# Altium project stm-hydro-top-board.PrjPcb
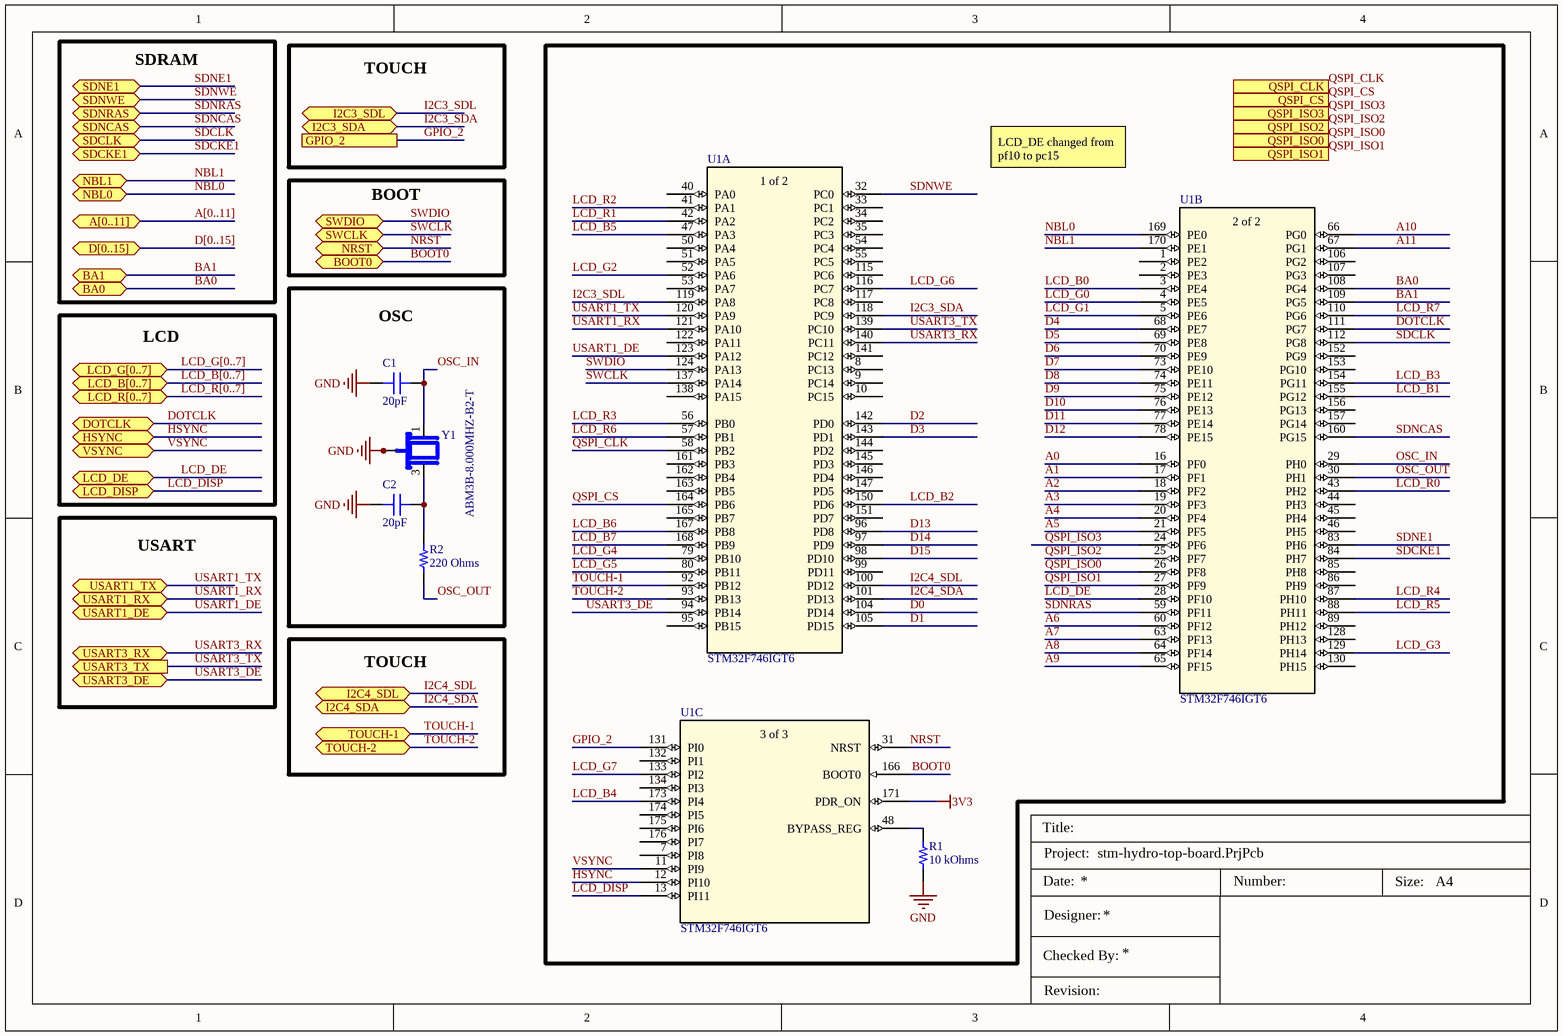
[diagram p0: STM-connections.SchDoc]
5 sheets, 47 parts. Net scope: flat (ports and power ports of the same name join across sheets).
Board file: PCB2.PcbDoc
Sheets:
  STM-connections.SchDoc
  STM-power-boot.SchDoc
  SDram.SchDoc
  LCD-connector.SchDoc
  BOARD-connector.SchDoc

## Sheet STM-connections.SchDoc
size A4; Organization: Altium Limited; Address1: L3, 12a Rodborough Rd; Address2: Frenchs Forest; Address3: NSW; Address4: Australia 2086

### Parts
C1  20pF  [CAP 0603_1608]
C2  20pF  [CAP 0603_1608]
R1  10 kOhms  [RES 0603_1608]
R2  220 Ohms  [RES 0603_1608]
U1  STM32F746IGT6  [LQFP176_24X24_STM]  (parts A,B,C of 4)
Y1  ABM3B-8.000MHZ-B2-T  [OSC_ABM3B-8.000MHZ-B2-T]

### Blocks framed on the sheet
OSC: C1 C2 R2 Y1

### Ports
A[0..11] (bidir), BA0 (bidir), BA1 (bidir), BOOT0 (bidir), D[0..15] (bidir), DOTCLK (bidir), GPIO_2, HSYNC (bidir), I2C3_SDA (bidir), I2C3_SDL (bidir), I2C4_SDA (bidir), I2C4_SDL (bidir), LCD_B[0..7] (bidir), LCD_DE (bidir), LCD_DISP (bidir), LCD_G[0..7] (bidir), LCD_R[0..7] (bidir), NBL0 (bidir), NBL1 (bidir), NRST (bidir), QSPI_CLK, QSPI_CS, QSPI_ISO0, QSPI_ISO1, QSPI_ISO2, QSPI_ISO3, SDCKE1 (bidir), SDCLK (bidir), SDNCAS (bidir), SDNE1 (bidir), SDNRAS (bidir), SDNWE (bidir), SWCLK (bidir), SWDIO (bidir), TOUCH-1 (bidir), TOUCH-2 (bidir), USART1_DE (bidir), USART1_RX (bidir), USART1_TX (bidir), USART3_DE (bidir), USART3_RX (bidir), USART3_TX (out), VSYNC (bidir)

### Nets
3V3: U1.171(PDR_ON)
GND: C1.1 C2.1 R1.1 Y1.2(GND) Y1.4(GND)
A0: U1.16(PF0)
A1: U1.17(PF1)
A2: U1.18(PF2)
A3: U1.19(PF3)
A4: U1.20(PF4)
A5: U1.21(PF5)
A6: U1.60(PF12)
A7: U1.63(PF13)
A8: U1.64(PF14)
A9: U1.65(PF15)
A10: U1.66(PG0)
A11: U1.67(PG1)
BA0: U1.108(PG4) ; port BA0
BA1: U1.109(PG5) ; port BA1
BOOT0: U1.166(BOOT0) ; port BOOT0
D0: U1.104(PD14)
D1: U1.105(PD15)
D2: U1.142(PD0)
D3: U1.143(PD1)
D4: U1.68(PE7)
D5: U1.69(PE8)
D6: U1.70(PE9)
D7: U1.73(PE10)
D8: U1.74(PE11)
D9: U1.75(PE12)
D10: U1.76(PE13)
D11: U1.77(PE14)
D12: U1.78(PE15)
D13: U1.96(PD8)
D14: U1.97(PD9)
D15: U1.98(PD10)
DOTCLK: U1.111(PG7) ; port DOTCLK
GPIO_2: U1.131(PI0) ; port GPIO_2
HSYNC: U1.12(PI10) ; port HSYNC
I2C3_SDA: U1.118(PC9) ; port I2C3_SDA
I2C3_SDL: U1.119(PA8) ; port I2C3_SDL
I2C4_SDA: U1.101(PD13) ; port I2C4_SDA
I2C4_SDL: U1.100(PD12) ; port I2C4_SDL
LCD_B0: U1.3(PE4)
LCD_B1: U1.155(PG12)
LCD_B2: U1.150(PD6)
LCD_B3: U1.154(PG11)
LCD_B4: U1.173(PI4)
LCD_B5: U1.47(PA3)
LCD_B6: U1.167(PB8)
LCD_B7: U1.168(PB9)
LCD_DE: U1.28(PF10) ; port LCD_DE
LCD_DISP: U1.13(PI11) ; port LCD_DISP
LCD_G0: U1.4(PE5)
LCD_G1: U1.5(PE6)
LCD_G2: U1.52(PA6)
LCD_G3: U1.129(PH14)
LCD_G4: U1.79(PB10)
LCD_G5: U1.80(PB11)
LCD_G6: U1.116(PC7)
LCD_G7: U1.133(PI2)
LCD_R0: U1.43(PH2)
LCD_R1: U1.42(PA2)
LCD_R2: U1.41(PA1)
LCD_R3: U1.56(PB0)
LCD_R4: U1.87(PH10)
LCD_R5: U1.88(PH11)
LCD_R6: U1.57(PB1)
LCD_R7: U1.110(PG6)
NBL0: U1.169(PE0) ; port NBL0
NBL1: U1.170(PE1) ; port NBL1
NRST: U1.31(NRST) ; port NRST
OSC_IN: C1.2 U1.29(PH0) Y1.1
OSC_OUT: R2.2 U1.30(PH1)
QSPI_CLK: U1.58(PB2) ; port QSPI_CLK
QSPI_CS: U1.164(PB6) ; port QSPI_CS
QSPI_ISO0: U1.26(PF8) ; port QSPI_ISO0
QSPI_ISO1: U1.27(PF9) ; port QSPI_ISO1
QSPI_ISO2: U1.25(PF7) ; port QSPI_ISO2
QSPI_ISO3: U1.24(PF6) ; port QSPI_ISO3
SDCKE1: U1.84(PH7) ; port SDCKE1
SDCLK: U1.112(PG8) ; port SDCLK
SDNCAS: U1.160(PG15) ; port SDNCAS
SDNE1: U1.83(PH6) ; port SDNE1
SDNRAS: U1.59(PF11) ; port SDNRAS
SDNWE: U1.32(PC0) ; port SDNWE
SWCLK: U1.137(PA14) ; port SWCLK
SWDIO: U1.124(PA13) ; port SWDIO
TOUCH-1: U1.92(PB12) ; port TOUCH-1
TOUCH-2: U1.93(PB13) ; port TOUCH-2
USART1_DE: U1.123(PA12) ; port USART1_DE
USART1_RX: U1.121(PA10) ; port USART1_RX
USART1_TX: U1.120(PA9) ; port USART1_TX
USART3_DE: U1.94(PB14) ; port USART3_DE
USART3_RX: U1.140(PC11) ; port USART3_RX
USART3_TX: U1.139(PC10) ; port USART3_TX
VSYNC: U1.11(PI9) ; port VSYNC
NetC2_2: C2.2 R2.1 Y1.3
NetR1_2: R1.2 U1.48(BYPASS_REG)

Not connected (* = marked no-connect by the designer): U1 1(PE2) 2(PE3) 7(PI8) 8(PC13) 9(PC14) 10(PC15) 33(PC1) 34(PC2) 35(PC3) 40(PA0) 44(PH3) 45(PH4) 46(PH5) 50(PA4) 51(PA5) 53(PA7) 54(PC4) 55(PC5) 85(PH8) 86(PH9) 89(PH12) 95(PB15) 99(PD11) 106(PG2) 107(PG3) 115(PC6) 117(PC8) 122(PA11) 128(PH13) 130(PH15) 132(PI1) 134(PI3) 138(PA15) 141(PC12) 144(PD2) 145(PD3) 146(PD4) 147(PD5) 151(PD7) 152(PG9) 153(PG10) 156(PG13) 157(PG14) 161(PB3) 162(PB4) 163(PB5) 165(PB7) 174(PI5) 175(PI6) 176(PI7)

### Buses and harness runs
bus A[0..11] = port A[0..11]
bus D[0..15] = port D[0..15]
bus LCD_B[0..7] = port LCD_B[0..7]
bus LCD_G[0..7] = port LCD_G[0..7]
bus LCD_R[0..7] = port LCD_R[0..7]

### Notes on the sheet
- SDRAM
- TOUCH
- LCD_DE changed from pf10 to pc15
- BOOT
- LCD
- USART
- Title:
- Project:
- Date:
- Designer:
- Number:
- Size:
- A4
- Checked By:
- Revision:
- (in symbol STM32F746IGT6, part A) 1 of 2
- (in symbol STM32F746IGT6, part B) 2 of 2
- (in symbol STM32F746IGT6, part C) 3 of 3

### Library data of the parts
C1 C2 = CC0603JRNPO0BN200: CAP CER 20PF 100V C0G/NPO 0603; Part Number: CC0603JRNPO0BN200; Value: 20pF
R1 = CRCW060310K0FKEAHP: RES SMD 10K OHM 1% 1/4W 0603; Part Number: CRCW060310K0FKEAHP; Value: 10 kOhms
R2 = CRCW0603220RJNEAHP: RES SMD 220 OHM 5% 1/4W 0603; Part Number: CRCW0603220RJNEAHP; Value: 220 Ohms
U1 = STM32F746IGT6: No Description Available; Built_By: EMA_Jessica; Vendor: STMicroelectronics; SourceLibrary: Add_to_database_2020-10-19; Copyright: Copyright (C) 2018 Accelerated Designs. All rights reserved; Manufacturer_Part_Number: STM32F746IGT6; RefDes: RefDes; Type: DEV
Y1 = ABM3B-8.000MHZ-B2-T: 8MHz Â±20ppm Crystal 18pF 200 Ohms 4-SMD, No Lead; MF: Abracon; Check_prices: https://www.snapeda.com/parts/ABM3B-8.000MHZ-B2-T/Abracon%20LLC/view-part/42698/?ref=eda; Price: None; SnapEDA_Link: https://www.snapeda.com/parts/ABM3B-8.000MHZ-B2-T/Abracon%20LLC/view-part/42698/?ref=snap; MP: ABM3B-8.000MHZ-B2-T; Value: *; Availability: Good; Package: SMD-4 Abracon LLC; Purchase-URL: https://pricing.snapeda.com/search/part/ABM3B-8.000MHZ-B2-T/?ref=eda

## Sheet STM-power-boot.SchDoc
size A4; Organization: Altium Limited; Address1: L3, 12a Rodborough Rd; Address2: Frenchs Forest; Address3: NSW; Address4: Australia 2086
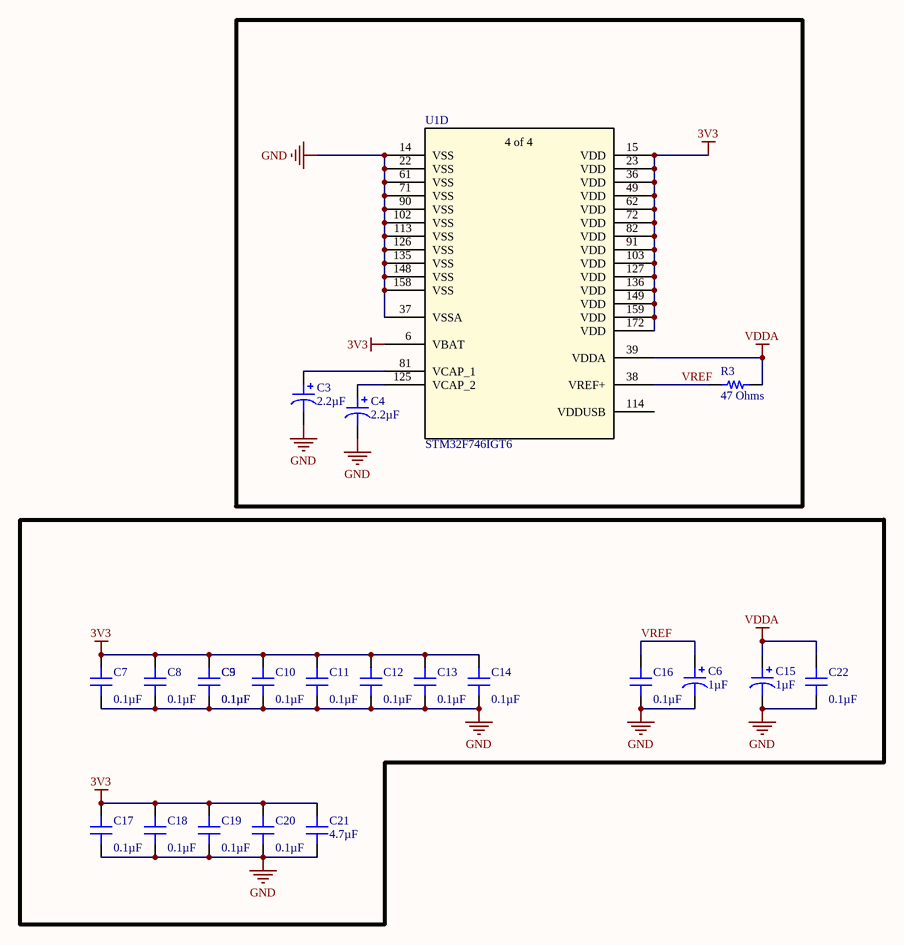
[diagram p1: STM-power-boot.SchDoc]

### Parts
C3  2.2µF  [CAP POL 1411_3528]
C4  2.2µF  [CAP POL 1411_3528]
C5  0.1µF  [CAP 0603_1608]
C6  1µF  [CAP POL 1206_3216]
C7  0.1µF  [CAP 0603_1608]
C8  0.1µF  [CAP 0603_1608]
C9  0.1µF  [CAP 0603_1608]
C10  0.1µF  [CAP 0603_1608]
C11  0.1µF  [CAP 0603_1608]
C12  0.1µF  [CAP 0603_1608]
C13  0.1µF  [CAP 0603_1608]
C14  0.1µF  [CAP 0603_1608]
C15  1µF  [CAP POL 1206_3216]
C16  0.1µF  [CAP 0603_1608]
C17  0.1µF  [CAP 0603_1608]
C18  0.1µF  [CAP 0603_1608]
C19  0.1µF  [CAP 0603_1608]
C20  0.1µF  [CAP 0603_1608]
C21  4.7µF  [CAP 0603_1608]
C22  0.1µF  [CAP 0603_1608]
R3  47 Ohms  [RES 0805_2012]
U1  STM32F746IGT6  [LQFP176_24X24_STM]  (part D of 4)

### Nets
3V3: C5.2 C7.2 C8.2 C9.2 C10.2 C11.2 C12.2 C13.2 C14.2 C17.2 C18.2 C19.2 C20.2 C21.2 U1.6(VBAT) U1.15(VDD) U1.23(VDD) U1.36(VDD) U1.49(VDD) U1.62(VDD) U1.72(VDD) U1.82(VDD) U1.91(VDD) U1.103(VDD) U1.127(VDD) U1.136(VDD) U1.149(VDD) U1.159(VDD) U1.172(VDD)
GND: C3.2 C4.2 C5.1 C6.2 C7.1 C8.1 C9.1 C10.1 C11.1 C12.1 C13.1 C14.1 C15.2 C16.1 C17.1 C18.1 C19.1 C20.1 C21.1 C22.1 U1.14(VSS) U1.22(VSS) U1.37(VSSA) U1.61(VSS) U1.71(VSS) U1.90(VSS) U1.102(VSS) U1.113(VSS) U1.126(VSS) U1.135(VSS) U1.148(VSS) U1.158(VSS)
VDDA: C15.1 C22.2 R3.1 U1.39(VDDA)
VREF: C6.1 C16.2 R3.2 U1.38(VREF+)
NetC3_1: C3.1 U1.81(VCAP_1)
NetC4_1: C4.1 U1.125(VCAP_2)

Not connected (* = marked no-connect by the designer): U1 114(VDDUSB)

### Notes on the sheet
- Title:
- Project:
- Date:
- Designer:
- Number:
- Size:
- A4
- Checked By:
- Revision:
- (in symbol STM32F746IGT6, part D) 4 of 4

### Library data of the parts
C3 C4 = T496B225M016ATE3K5: CAP TANT 2.2UF 20% 16V 1411; Manufacturer: KEMET; Manufacturer Size Code: B; ESR (Equivalent Series Resistance): 3.5Ohm; Lifetime @ Temp.: 2000 Hrs @ 85°C; Type: Molded; Part Number: T496B225M016ATE3K5; Value: 2.2µF; Capacitance: 2.2µF; ComponentLink1Description: Datasheet; ComponentLink1URL: https://api.kemet.com/component-edge/download/datasheet/T496B225M016ATE3K5.pdf; ComponentLink2Description: DigiKey Link; ComponentLink2URL: http://digikey.com/product-detail/en/kemet/T496B225M016ATE3K5/399-3917-1-ND/819242; Device Package: 1411 (3528 Metric); Features: Fail Safe with Built-in Fuse; Height - Seated (Max): 0.083" (2.10mm); LastUpdated: 9/2/2020 1:15:46 AM; Lifecycle Status: Active; Minimum Order: 1; Mounting Type: Surface Mount; Operating Temperature: -55°C ~ 125°C; Package / Case: 1411 (3528 Metric); Packaging: TapeAndReel; PartId: 12; Part Status: Active; Price: 0.51; Series: T496; Size / Dimension: 0.138" L x 0.110" W (3.50mm x 2.80mm); Supplier 1: DigiKey; Supplier Part Number 1: 399-3917-1-ND; Tolerance: ±20%; Voltage - Rated: 16V
C5 C7-C14 C16-C20 C22 = 6R3X14W104MV4T: CAP CER 0.1UF 6.3V X7R 0603; Part Number: 6R3X14W104MV4T; Value: 0.1µF
C6 C15 = T494A105M016AT: CAP TANT 1UF 20% 16V 1206; Manufacturer: KEMET; Manufacturer Size Code: A; ESR (Equivalent Series Resistance): 6Ohm; Lifetime @ Temp.: 2000 Hrs @ 125°C; Type: Molded; Part Number: T494A105M016AT; Value: 1µF; Capacitance: 1µF; ComponentLink1Description: Datasheet; ComponentLink1URL: https://api.kemet.com/component-edge/download/datasheet/T494A105M016AT.pdf; ComponentLink2Description: DigiKey Link; ComponentLink2URL: http://digikey.com/product-detail/en/kemet/T494A105M016AT/399-8429-1-ND/3472152; Device Package: 1206 (3216 Metric); Features: General Purpose; Height - Seated (Max): 0.071" (1.80mm); LastUpdated: 9/2/2020 1:15:52 AM; Lifecycle Status: Active; Minimum Order: 1; Mounting Type: Surface Mount; Operating Temperature: -55°C ~ 125°C; Package / Case: 1206 (3216 Metric); Packaging: TapeAndReel; PartId: 2393; Part Status: Active; Price: 0.20; Series: T494; Size / Dimension: 0.126" L x 0.063" W (3.20mm x 1.60mm); Supplier 1: DigiKey; Supplier Part Number 1: 399-8429-1-ND; Tolerance: ±20%; Voltage - Rated: 16V
C21 = C0603C475K9PACTU: CAP CER 4.7UF 6.3V X5R 0603; Part Number: C0603C475K9PACTU; Value: 4.7µF
R3 = CRGP0805F47R: CRGP 0805 47R 1%; Manufacturer: TE Connectivity Passive Product; Power (Watts): 0.333W, 1/3W; Temperature Coefficient: ±200ppm/°C; Part Number: CRGP0805F47R; Value: 47 Ohms; ComponentLink1Description: Datasheet; ComponentLink1URL: https://www.te.com/commerce/DocumentDelivery/DDEController?Action=srchrtrv&DocNm=9-1773463-9&DocType=DS&DocLang=English; ComponentLink2Description: DigiKey Link; ComponentLink2URL: http://digikey.com/product-detail/en/te-connectivity-passive-product/CRGP0805F47R/A130461CT-ND/8578293; Composition: Thick Film; Device Package: 0805 (2012 Metric); Features: Pulse Withstanding; Height - Seated (Max): 0.026" (0.65mm); LastUpdated: 9/2/2020 1:15:22 AM; Lifecycle Status: Active; Minimum Order: 1; Number of Terminations: 2; Operating Temperature: -55°C ~ 155°C; Package / Case: 0805 (2012 Metric); Packaging: TapeAndReel; PartId: 28763; Part Status: Active; Price: 0.02; Resistance: 47 Ohms; Series: CRGP; Size / Dimension: 0.079" L x 0.049" W (2.00mm x 1.25mm); Supplier 1: DigiKey; Supplier Part Number 1: A130461CT-ND; Supplier Device Package: 0805; Tolerance: ±1%
U1 = STM32F746IGT6: as U1 on sheet STM-connections; Copyright: Copyright (C) 2018 Accelerated Designs. All rights reserved; Manufacturer_Part_Number: STM32F746IGT6; RefDes: RefDes; Type: DEV

## Sheet SDram.SchDoc
size A4; Organization: Altium Limited; Address1: L3, 12a Rodborough Rd; Address2: Frenchs Forest; Address3: NSW; Address4: Australia 2086
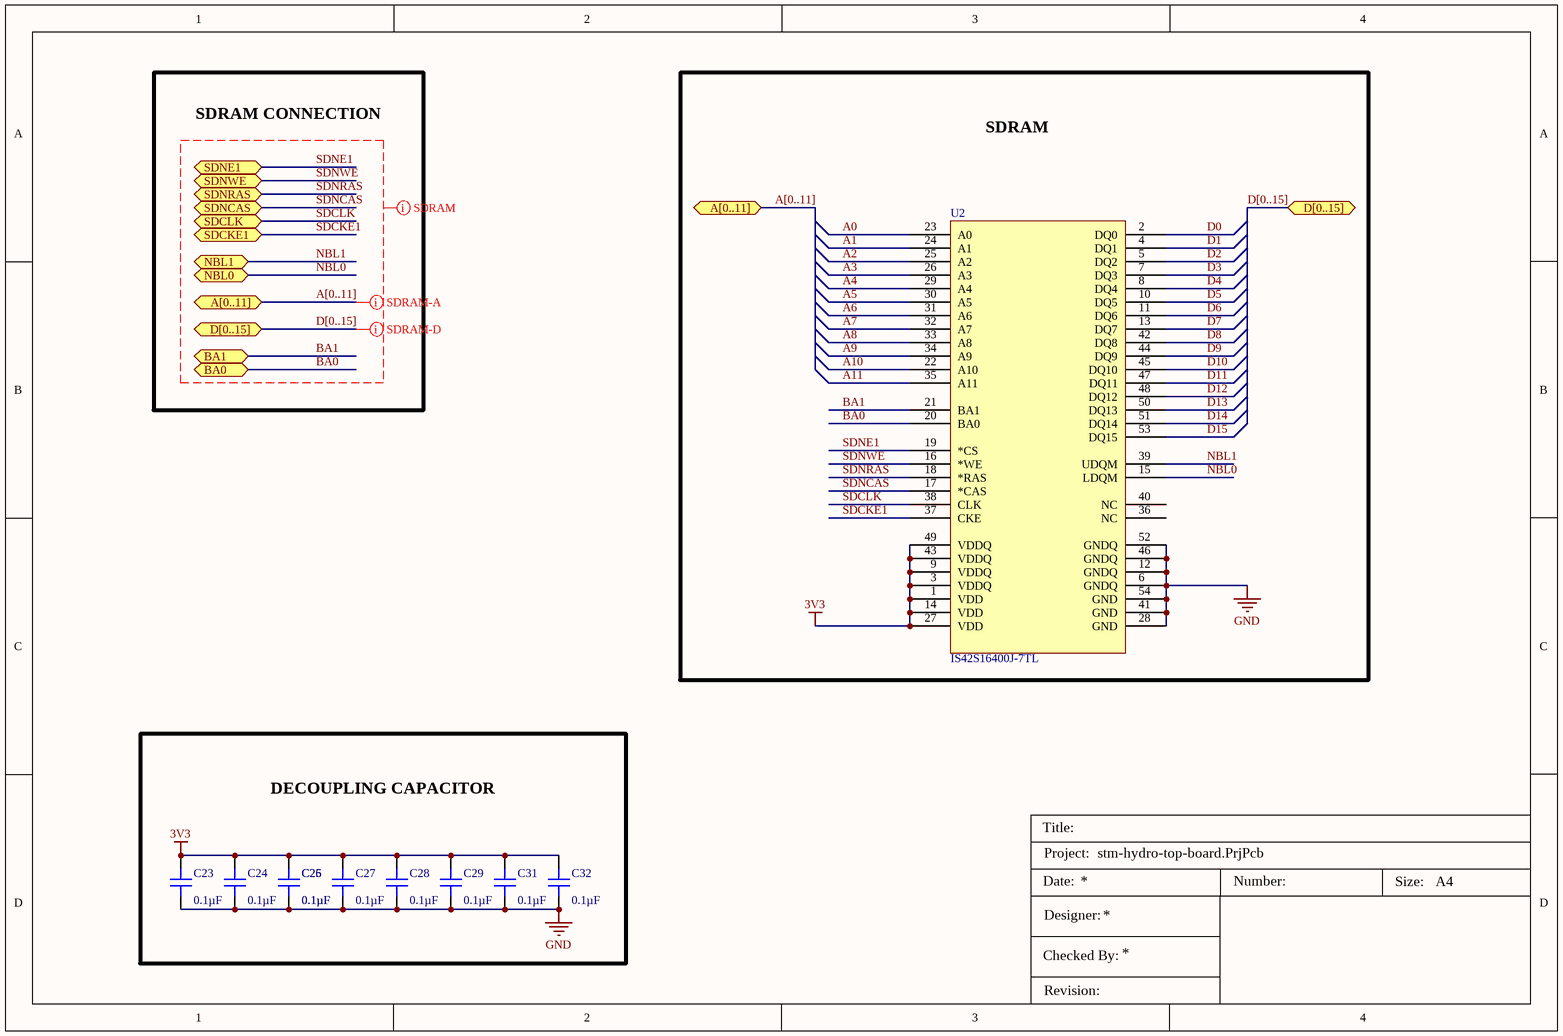
[diagram p2: SDram.SchDoc]

### Parts
C23  0.1µF  [CAP 0603_1608]
C24  0.1µF  [CAP 0603_1608]
C25  0.1µF  [CAP 0603_1608]
C26  0.1µF  [CAP 0603_1608]
C27  0.1µF  [CAP 0603_1608]
C28  0.1µF  [CAP 0603_1608]
C29  0.1µF  [CAP 0603_1608]
C31  0.1µF  [CAP 0603_1608]
C32  0.1µF  [CAP 0603_1608]
U2  IS42S16400J-7TL  [sdram]

### Blocks framed on the sheet
SDRAM: U2
DECOUPLING CAPACITOR: C23-C29 C31 C32

### Ports
A[0..11] (bidir), BA0 (bidir), BA1 (bidir), D[0..15] (bidir), NBL0 (bidir), NBL1 (bidir), SDCKE1 (bidir), SDCLK (bidir), SDNCAS (bidir), SDNE1 (bidir), SDNRAS (bidir), SDNWE (bidir)

### Nets
3V3: C23.2 C24.2 C25.2 C26.2 C27.2 C28.2 C29.2 C31.2 C32.2 U2.1(VDD) U2.3(VDDQ) U2.9(VDDQ) U2.14(VDD) U2.27(VDD) U2.43(VDDQ) U2.49(VDDQ)
GND: C23.1 C24.1 C25.1 C26.1 C27.1 C28.1 C29.1 C31.1 C32.1 U2.6(GNDQ) U2.12(GNDQ) U2.28(GND) U2.41(GND) U2.46(GNDQ) U2.52(GNDQ) U2.54(GND)
A0: U2.23(A0)
A1: U2.24(A1)
A2: U2.25(A2)
A3: U2.26(A3)
A4: U2.29(A4)
A5: U2.30(A5)
A6: U2.31(A6)
A7: U2.32(A7)
A8: U2.33(A8)
A9: U2.34(A9)
A10: U2.22(A10)
A11: U2.35(A11)
BA0: U2.20(BA0) ; port BA0
BA1: U2.21(BA1) ; port BA1
D0: U2.2(DQ0)
D1: U2.4(DQ1)
D2: U2.5(DQ2)
D3: U2.7(DQ3)
D4: U2.8(DQ4)
D5: U2.10(DQ5)
D6: U2.11(DQ6)
D7: U2.13(DQ7)
D8: U2.42(DQ8)
D9: U2.44(DQ9)
D10: U2.45(DQ10)
D11: U2.47(DQ11)
D12: U2.48(DQ12)
D13: U2.50(DQ13)
D14: U2.51(DQ14)
D15: U2.53(DQ15)
NBL0: U2.15(LDQM) ; port NBL0
NBL1: U2.39(UDQM) ; port NBL1
SDCKE1: U2.37(CKE) ; port SDCKE1
SDCLK: U2.38(CLK) ; port SDCLK
SDNCAS: U2.17(*CAS) ; port SDNCAS
SDNE1: U2.19(*CS) ; port SDNE1
SDNRAS: U2.18(*RAS) ; port SDNRAS
SDNWE: U2.16(*WE) ; port SDNWE

Not connected (* = marked no-connect by the designer): U2 36(NC) 40(NC)

### Buses and harness runs
bus A[0..11] = port A[0..11]
bus D[0..15] = port D[0..15]

### Layout directives
net class SDRAM: A[0..11], BA0, BA1, D[0..15], NBL0, NBL1, SDCKE1, SDCLK, SDNCAS, SDNE1, SDNRAS, SDNWE
net class SDRAM-A: A[0..11], BA0, BA1, D[0..15], NBL0, NBL1, SDCKE1, SDCLK, SDNCAS, SDNE1, SDNRAS, SDNWE
net class SDRAM-D: A[0..11], BA0, BA1, D[0..15], NBL0, NBL1, SDCKE1, SDCLK, SDNCAS, SDNE1, SDNRAS, SDNWE

### Notes on the sheet
- SDRAM CONNECTION
- Title:
- Project:
- Date:
- Designer:
- Number:
- Size:
- A4
- Checked By:
- Revision:

### Library data of the parts
C23-C29 C31 C32 = 6R3X14W104MV4T: CAP CER 0.1UF 6.3V X7R 0603; Part Number: 6R3X14W104MV4T; Value: 0.1µF
U2 = IS42S16400J-7TL: No Description AvailablSDRAM Memory IC 64Mb (4M x 16) Parallel 143 MHz 5.4 ns 54-TSOP IIe; Vendor: ISSI; Built_By: EMA_Cory; SourceLibrary: Add_to_database_2020-12-24; Datasheet: http://www.issi.com/WW/pdf/42-45S16400J.pdf; Manufacturer_Part_Number: IS42S16400J-7TL; Copyright: Copyright (C) 2018 Accelerated Designs. All rights reserved; RefDes: RefDes; Type: DEV; ComponentLink1Description: New link; ComponentLink1URL: https://www.digikey.be/en/products/detail/issi-integrated-silicon-solution-inc/IS42S16400J-7TL/2708623

## Sheet LCD-connector.SchDoc
size A4; Organization: Altium Limited; Address1: L3, 12a Rodborough Rd; Address2: Frenchs Forest; Address3: NSW; Address4: Australia 2086
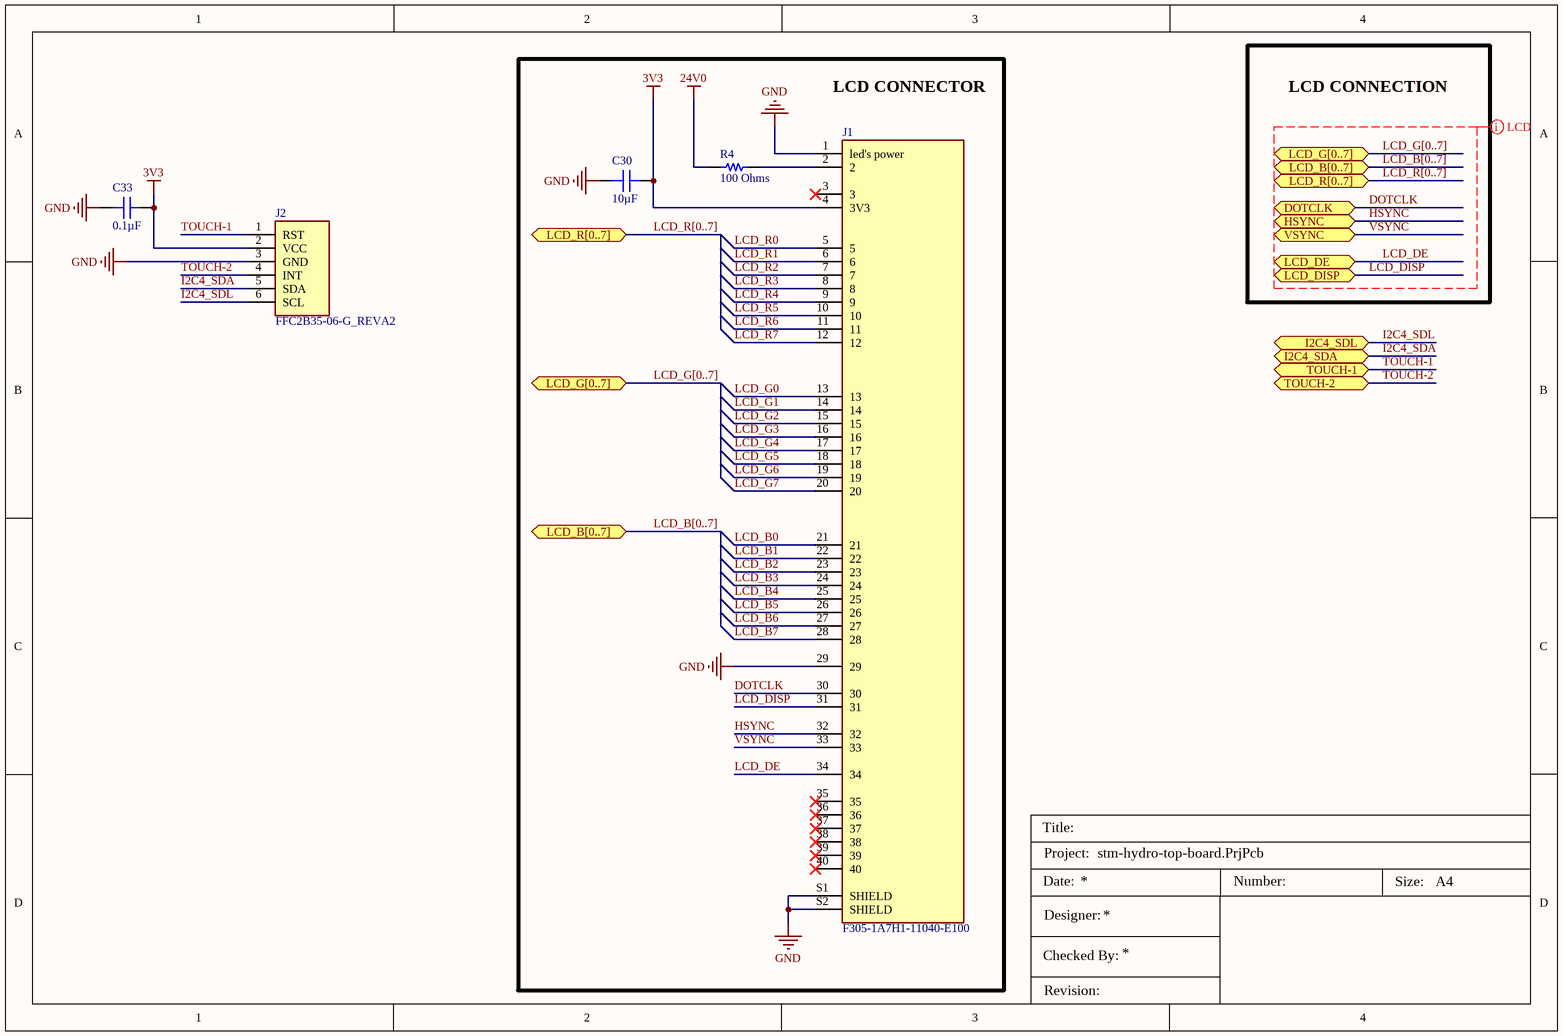
[diagram p3: LCD-connector.SchDoc]

### Parts
C30  10µF  [CAP 0805_2012]
C33  0.1µF  [CAP 0603_1608]
J1  F305-1A7H1-11040-E100  [F305-1A7H1-11040-E100]
J2  FFC2B35-06-G_REVA2  [GCT_FFC2B35-06-G_REVA2]
R4  100 Ohms  [RES 1206_3216]

### Blocks framed on the sheet
LCD CONNECTOR: C30 J1 R4

### Ports
DOTCLK (bidir), HSYNC (bidir), I2C4_SDA (bidir), I2C4_SDL (bidir), LCD_B[0..7] (bidir), LCD_DE (bidir), LCD_DISP (bidir), LCD_G[0..7] (bidir), LCD_R[0..7] (bidir), TOUCH-1 (bidir), TOUCH-2 (bidir), VSYNC (bidir)

### Nets
3V3: C30.2 C33.1 J1.4(3V3) J2.2(VCC)
24V0: R4.1
GND: C30.1 C33.2 J1.1(led's_power) J1.29 J1.S1(SHIELD) J1.S2(SHIELD) J2.3(GND)
DOTCLK: J1.30 ; port DOTCLK
HSYNC: J1.32 ; port HSYNC
I2C4_SDA: J2.5(SDA) ; port I2C4_SDA
I2C4_SDL: J2.6(SCL) ; port I2C4_SDL
LCD_B0: J1.21
LCD_B1: J1.22
LCD_B2: J1.23
LCD_B3: J1.24
LCD_B4: J1.25
LCD_B5: J1.26
LCD_B6: J1.27
LCD_B7: J1.28
LCD_DE: J1.34 ; port LCD_DE
LCD_DISP: J1.31 ; port LCD_DISP
LCD_G0: J1.13
LCD_G1: J1.14
LCD_G2: J1.15
LCD_G3: J1.16
LCD_G4: J1.17
LCD_G5: J1.18
LCD_G6: J1.19
LCD_G7: J1.20
LCD_R0: J1.5
LCD_R1: J1.6
LCD_R2: J1.7
LCD_R3: J1.8
LCD_R4: J1.9
LCD_R5: J1.10
LCD_R6: J1.11
LCD_R7: J1.12
TOUCH-1: J2.1(RST) ; port TOUCH-1
TOUCH-2: J2.4(INT) ; port TOUCH-2
VSYNC: J1.33 ; port VSYNC
NetJ1_2: J1.2 R4.2

Not connected (* = marked no-connect by the designer): J1 3* 35* 36* 37* 38* 39* 40*

### Buses and harness runs
bus LCD_B[0..7] = port LCD_B[0..7]
bus LCD_G[0..7] = port LCD_G[0..7]
bus LCD_R[0..7] = port LCD_R[0..7]

### Layout directives
net class LCD: DOTCLK, HSYNC, LCD_B[0..7], LCD_DE, LCD_DISP, LCD_G[0..7], LCD_R[0..7], VSYNC

### Notes on the sheet
- LCD CONNECTION
- Title:
- Project:
- Date:
- Designer:
- Number:
- Size:
- A4
- Checked By:
- Revision:

### Library data of the parts
C30 = CL21A106MQFNNNE: CAP CER 10UF 6.3V X5R 0805; Manufacturer: Samsung Electro-Mechanics; Tolerance: ±20%; Part Number: CL21A106MQFNNNE; Value: 10µF; Applications: General Purpose; Capacitance: 10µF; ComponentLink1Description: Datasheet; ComponentLink1URL: http://www.samsungsem.com/kr/support/product-search/mlcc/CL21A106MQFNNNE.jsp; ComponentLink2Description: DigiKey Link; ComponentLink2URL: http://digikey.com/product-detail/en/samsung-electro-mechanics/CL21A106MQFNNNE/1276-1298-1-ND/3889384; Device Package: 0805 (2012 Metric); LastUpdated: 9/2/2020 1:04:40 AM; Lifecycle Status: Active; Minimum Order: 1; Mounting Type: Surface Mount, MLCC; Operating Temperature: -55°C ~ 85°C; Package / Case: 0805 (2012 Metric); Packaging: TapeAndReel; PartId: 3169; Part Status: Active; Price: 0.02; Series: CL; Size / Dimension: 0.079" L x 0.049" W (2.00mm x 1.25mm); Supplier 1: DigiKey; Supplier Part Number 1: 1276-1298-1-ND; Temperature Coefficient: X5R; Thickness (Max): 0.053" (1.35mm); Voltage - Rated: 6.3V
C33 = 6R3X14W104MV4T: CAP CER 0.1UF 6.3V X7R 0603; Part Number: 6R3X14W104MV4T; Value: 0.1µF
J1 = LCD Connector: 40 Position FFC, FPC Connector Contacts, Bottom 0.020" (0.50mm) Surface Mount, Right Angle; MF: Amphenol ICC (FCI); MP: F305-1A7H1-11040-E100; Price: None; Availability: Unavailable; Package: None; Digikey_Link: https://www.digikey.com/en/products/detail/amphenol-icc-fci/F305-1A7H1-11040-E100/11564644; Value: *
J2 = FFC2B35-06-G_REVA2: 0.5mm Side entry Flat Flexible Cable Connector; MF: Global Connector Technology; SnapEDA_Link: https://www.snapeda.com/parts/FFC2B35-06-G/Global+Connector+Technology/view-part/?ref=snap; Price: None; Check_prices: https://www.snapeda.com/parts/FFC2B35-06-G/Global+Connector+Technology/view-part/?ref=eda; Availability: In Stock; Value: *; MP: FFC2B35-06-G; Package: None; Purchase-URL: https://pricing.snapeda.com/search/part/FFC2B35-06-G/?ref=eda
R4 = CRG1206F100R: RES SMD 100 OHM 1% 1/4W 1206; Manufacturer: TE Connectivity Passive Product; Power (Watts): 0.25W, 1/4W; Temperature Coefficient: ±200ppm/°C; Part Number: CRG1206F100R; ComponentLink1Description: Datasheet; ComponentLink1URL: https://www.te.com/commerce/DocumentDelivery/DDEController?Action=srchrtrv&DocNm=1773204&DocType=DS&DocLang=English; ComponentLink2Description: DigiKey Link; ComponentLink2URL: http://digikey.com/product-detail/en/te-connectivity-passive-product/CRG1206F100R/A106068CT-ND/3477719; Composition: Thick Film; Device Package: 1206 (3216 Metric); Height - Seated (Max): 0.026" (0.65mm); LastUpdated: 9/2/2020 1:13:10 AM; Lifecycle Status: Active; Minimum Order: 1; Number of Terminations: 2; Operating Temperature: -55°C ~ 155°C; Package / Case: 1206 (3216 Metric); Packaging: TapeAndReel; PartId: 26991; Part Status: Active; Price: 0.01; Resistance: 100 Ohms; Series: CRG, Neohm; Size / Dimension: 0.122" L x 0.061" W (3.10mm x 1.55mm); Supplier 1: DigiKey; Supplier Part Number 1: A106068CT-ND; Supplier Device Package: 1206; Tolerance: ±1%; Value: 100 Ohms

## Sheet BOARD-connector.SchDoc
size A4; Organization: Altium Limited; Address1: L3, 12a Rodborough Rd; Address2: Frenchs Forest; Address3: NSW; Address4: Australia 2086
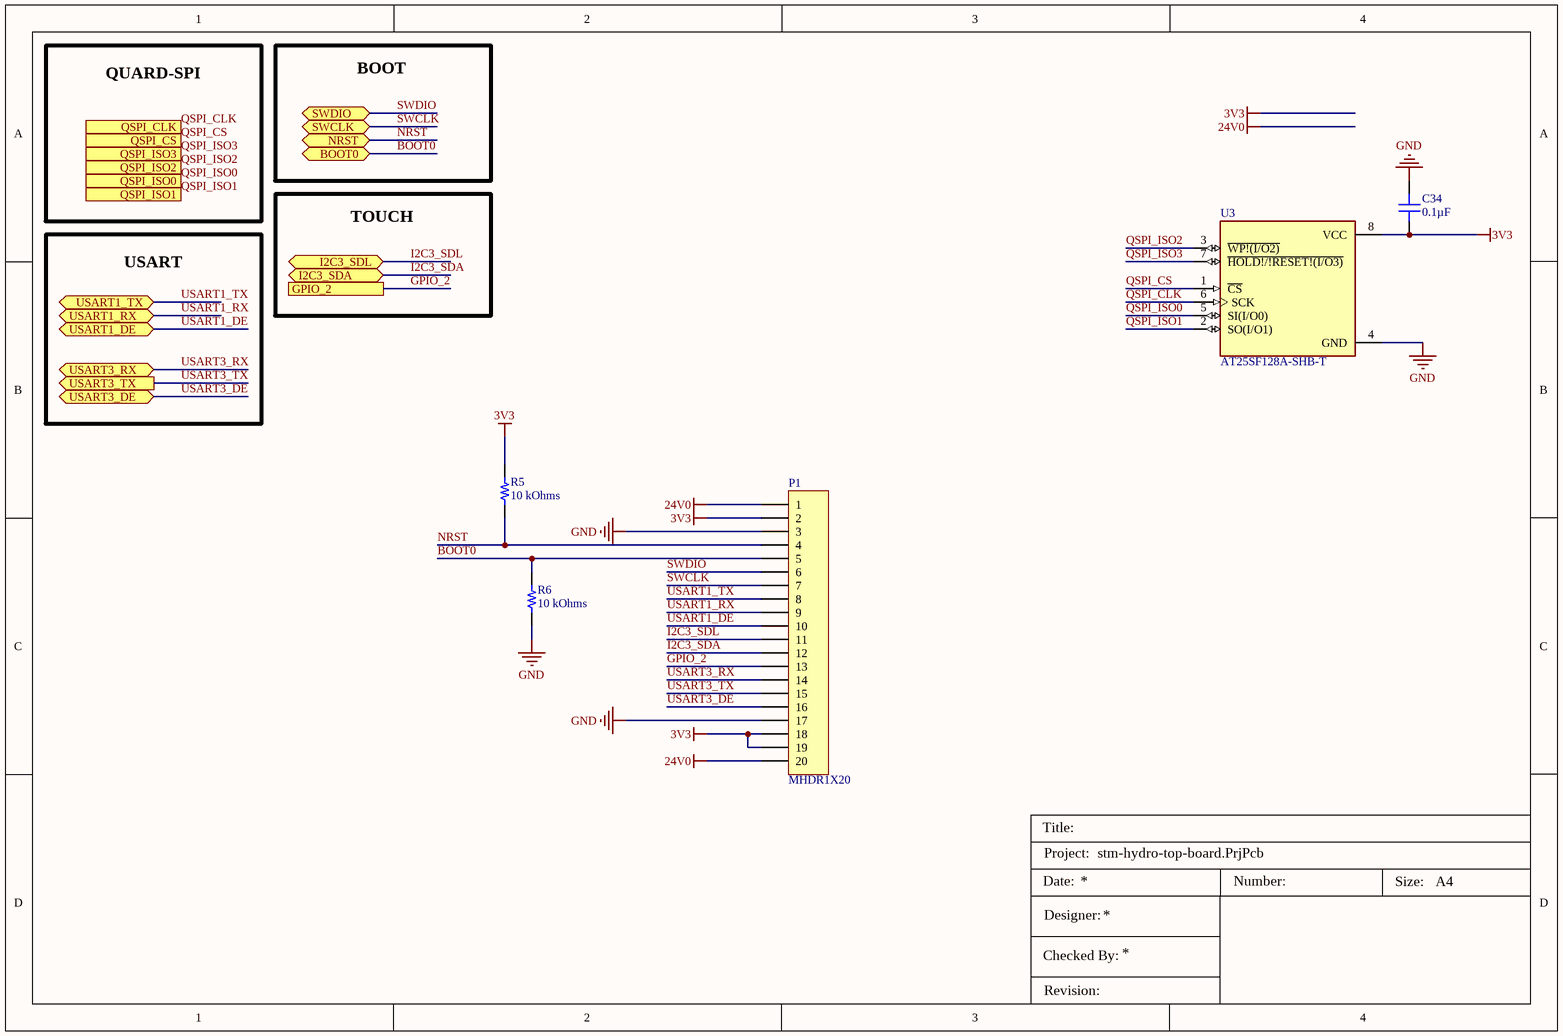
[diagram p4: BOARD-connector.SchDoc]

### Parts
C34  0.1µF  [CAP 0603_1608]
P1  MHDR1X20  [MHDR1X20]
R5  10 kOhms  [RES 0603_1608]
R6  10 kOhms  [RES 0603_1608]
U3  AT25SF128A-SHB-T  [SOIC127P790X216-8N]

### Ports
BOOT0 (bidir), GPIO_2, I2C3_SDA (bidir), I2C3_SDL (bidir), NRST (bidir), QSPI_CLK, QSPI_CS, QSPI_ISO0, QSPI_ISO1, QSPI_ISO2, QSPI_ISO3, SWCLK (bidir), SWDIO (bidir), USART1_DE (bidir), USART1_RX (bidir), USART1_TX (bidir), USART3_DE (bidir), USART3_RX (bidir), USART3_TX (out)

### Nets
3V3: C34.1 P1.2 P1.18 P1.19 R5.2 U3.8(VCC)
24V0: P1.1 P1.20
GND: C34.2 P1.3 P1.17 R6.1 U3.4(GND)
BOOT0: P1.5 R6.2 ; port BOOT0
GPIO_2: P1.13 ; port GPIO_2
I2C3_SDA: P1.12 ; port I2C3_SDA
I2C3_SDL: P1.11 ; port I2C3_SDL
NRST: P1.4 R5.1 ; port NRST
QSPI_CLK: U3.6(SCK) ; port QSPI_CLK
QSPI_CS: U3.1(~{CS}) ; port QSPI_CS
QSPI_ISO0: U3.5(SI(I/O0)) ; port QSPI_ISO0
QSPI_ISO1: U3.2(SO(I/O1)) ; port QSPI_ISO1
QSPI_ISO2: U3.3(~{WP!(I/O2)}) ; port QSPI_ISO2
QSPI_ISO3: U3.7(~{HOLD!/!RESET!(I/O3)}) ; port QSPI_ISO3
SWCLK: P1.7 ; port SWCLK
SWDIO: P1.6 ; port SWDIO
USART1_DE: P1.10 ; port USART1_DE
USART1_RX: P1.9 ; port USART1_RX
USART1_TX: P1.8 ; port USART1_TX
USART3_DE: P1.16 ; port USART3_DE
USART3_RX: P1.14 ; port USART3_RX
USART3_TX: P1.15 ; port USART3_TX

### Notes on the sheet
- QUARD-SPI
- BOOT
- TOUCH
- USART
- Title:
- Project:
- Date:
- Designer:
- Number:
- Size:
- A4
- Checked By:
- Revision:

### Library data of the parts
C34 = 6R3X14W104MV4T: CAP CER 0.1UF 6.3V X7R 0603; Part Number: 6R3X14W104MV4T; Value: 0.1µF
P1 = MHDR1X20: Header, 20-Pin; LatestRevisionDate: 17-Jul-2002; LatestRevisionNote: Re-released for DXP Platform.; Publisher: Altium Limited
R5 R6 = CRCW060310K0FKEAHP: RES SMD 10K OHM 1% 1/4W 0603; Part Number: CRCW060310K0FKEAHP; Value: 10 kOhms
U3 = AT25SF128A-SHB-T: 128 Mbit Serial NOR Flash Memory with Dual and Quad I/O Support; MF: Dialog Semiconductor; Value: *; Purchase-URL: https://pricing.snapeda.com/search/part/AT25SF128A-SHB-T/?ref=eda; Package: SOIC-8 Dialog Semiconductor; MP: AT25SF128A-SHB-T; Check_prices: https://www.snapeda.com/parts/AT25SF128A-SHB-T/Dialog%20Semiconductor/view-part/5488499/?ref=eda; SnapEDA_Link: https://www.snapeda.com/parts/AT25SF128A-SHB-T/Dialog%20Semiconductor/view-part/5488499/?ref=snap; Price: None; Availability: Warning

## Nets that join several sheets
3V3: STM-connections (U1.171), STM-power-boot (29 pins), SDram (16 pins), LCD-connector (C30.2 C33.1 J1.4 J2.2), BOARD-connector (6 pins)
24V0: LCD-connector (R4.1), BOARD-connector (P1.1 P1.20)
GND: STM-connections (5 pins), STM-power-boot (32 pins), SDram (16 pins), LCD-connector (7 pins), BOARD-connector (5 pins)
A0: STM-connections (U1.16), SDram (U2.23)
A1: STM-connections (U1.17), SDram (U2.24)
A2: STM-connections (U1.18), SDram (U2.25)
A3: STM-connections (U1.19), SDram (U2.26)
A4: STM-connections (U1.20), SDram (U2.29)
A5: STM-connections (U1.21), SDram (U2.30)
A6: STM-connections (U1.60), SDram (U2.31)
A7: STM-connections (U1.63), SDram (U2.32)
A8: STM-connections (U1.64), SDram (U2.33)
A9: STM-connections (U1.65), SDram (U2.34)
A10: STM-connections (U1.66), SDram (U2.22)
A11: STM-connections (U1.67), SDram (U2.35)
BA0: STM-connections (U1.108), SDram (U2.20)
BA1: STM-connections (U1.109), SDram (U2.21)
BOOT0: STM-connections (U1.166), BOARD-connector (P1.5 R6.2)
D0: STM-connections (U1.104), SDram (U2.2)
D1: STM-connections (U1.105), SDram (U2.4)
D2: STM-connections (U1.142), SDram (U2.5)
D3: STM-connections (U1.143), SDram (U2.7)
D4: STM-connections (U1.68), SDram (U2.8)
D5: STM-connections (U1.69), SDram (U2.10)
D6: STM-connections (U1.70), SDram (U2.11)
D7: STM-connections (U1.73), SDram (U2.13)
D8: STM-connections (U1.74), SDram (U2.42)
D9: STM-connections (U1.75), SDram (U2.44)
D10: STM-connections (U1.76), SDram (U2.45)
D11: STM-connections (U1.77), SDram (U2.47)
D12: STM-connections (U1.78), SDram (U2.48)
D13: STM-connections (U1.96), SDram (U2.50)
D14: STM-connections (U1.97), SDram (U2.51)
D15: STM-connections (U1.98), SDram (U2.53)
DOTCLK: STM-connections (U1.111), LCD-connector (J1.30)
GPIO_2: STM-connections (U1.131), BOARD-connector (P1.13)
HSYNC: STM-connections (U1.12), LCD-connector (J1.32)
I2C3_SDA: STM-connections (U1.118), BOARD-connector (P1.12)
I2C3_SDL: STM-connections (U1.119), BOARD-connector (P1.11)
I2C4_SDA: STM-connections (U1.101), LCD-connector (J2.5)
I2C4_SDL: STM-connections (U1.100), LCD-connector (J2.6)
LCD_B0: STM-connections (U1.3), LCD-connector (J1.21)
LCD_B1: STM-connections (U1.155), LCD-connector (J1.22)
LCD_B2: STM-connections (U1.150), LCD-connector (J1.23)
LCD_B3: STM-connections (U1.154), LCD-connector (J1.24)
LCD_B4: STM-connections (U1.173), LCD-connector (J1.25)
LCD_B5: STM-connections (U1.47), LCD-connector (J1.26)
LCD_B6: STM-connections (U1.167), LCD-connector (J1.27)
LCD_B7: STM-connections (U1.168), LCD-connector (J1.28)
LCD_DE: STM-connections (U1.28), LCD-connector (J1.34)
LCD_DISP: STM-connections (U1.13), LCD-connector (J1.31)
LCD_G0: STM-connections (U1.4), LCD-connector (J1.13)
LCD_G1: STM-connections (U1.5), LCD-connector (J1.14)
LCD_G2: STM-connections (U1.52), LCD-connector (J1.15)
LCD_G3: STM-connections (U1.129), LCD-connector (J1.16)
LCD_G4: STM-connections (U1.79), LCD-connector (J1.17)
LCD_G5: STM-connections (U1.80), LCD-connector (J1.18)
LCD_G6: STM-connections (U1.116), LCD-connector (J1.19)
LCD_G7: STM-connections (U1.133), LCD-connector (J1.20)
LCD_R0: STM-connections (U1.43), LCD-connector (J1.5)
LCD_R1: STM-connections (U1.42), LCD-connector (J1.6)
LCD_R2: STM-connections (U1.41), LCD-connector (J1.7)
LCD_R3: STM-connections (U1.56), LCD-connector (J1.8)
LCD_R4: STM-connections (U1.87), LCD-connector (J1.9)
LCD_R5: STM-connections (U1.88), LCD-connector (J1.10)
LCD_R6: STM-connections (U1.57), LCD-connector (J1.11)
LCD_R7: STM-connections (U1.110), LCD-connector (J1.12)
NBL0: STM-connections (U1.169), SDram (U2.15)
NBL1: STM-connections (U1.170), SDram (U2.39)
NRST: STM-connections (U1.31), BOARD-connector (P1.4 R5.1)
QSPI_CLK: STM-connections (U1.58), BOARD-connector (U3.6)
QSPI_CS: STM-connections (U1.164), BOARD-connector (U3.1)
QSPI_ISO0: STM-connections (U1.26), BOARD-connector (U3.5)
QSPI_ISO1: STM-connections (U1.27), BOARD-connector (U3.2)
QSPI_ISO2: STM-connections (U1.25), BOARD-connector (U3.3)
QSPI_ISO3: STM-connections (U1.24), BOARD-connector (U3.7)
SDCKE1: STM-connections (U1.84), SDram (U2.37)
SDCLK: STM-connections (U1.112), SDram (U2.38)
SDNCAS: STM-connections (U1.160), SDram (U2.17)
SDNE1: STM-connections (U1.83), SDram (U2.19)
SDNRAS: STM-connections (U1.59), SDram (U2.18)
SDNWE: STM-connections (U1.32), SDram (U2.16)
SWCLK: STM-connections (U1.137), BOARD-connector (P1.7)
SWDIO: STM-connections (U1.124), BOARD-connector (P1.6)
TOUCH-1: STM-connections (U1.92), LCD-connector (J2.1)
TOUCH-2: STM-connections (U1.93), LCD-connector (J2.4)
USART1_DE: STM-connections (U1.123), BOARD-connector (P1.10)
USART1_RX: STM-connections (U1.121), BOARD-connector (P1.9)
USART1_TX: STM-connections (U1.120), BOARD-connector (P1.8)
USART3_DE: STM-connections (U1.94), BOARD-connector (P1.16)
USART3_RX: STM-connections (U1.140), BOARD-connector (P1.14)
USART3_TX: STM-connections (U1.139), BOARD-connector (P1.15)
VSYNC: STM-connections (U1.11), LCD-connector (J1.33)